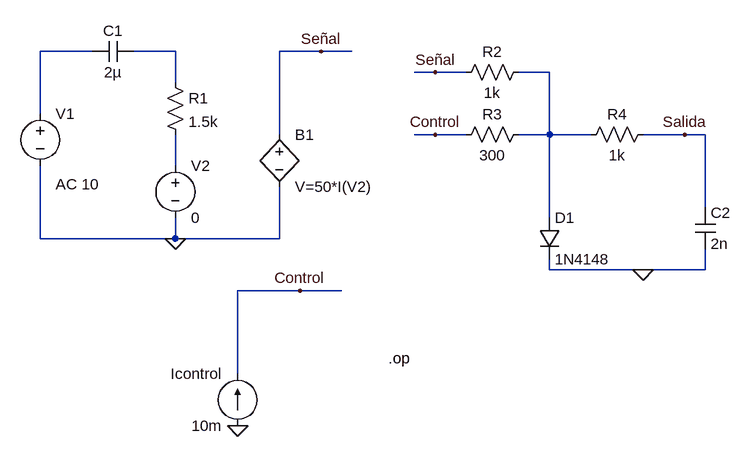
[diagram p0: schematic 2016-10-04 (1).asc]
2016-10-04 (1).asc, the LTspice schematic file:
Version 4
SHEET 1 988 680
WIRE -16 -16 -96 -16
WIRE 112 -16 48 -16
WIRE 336 -16 272 -16
WIRE 384 -16 336 -16
WIRE 512 16 480 16
WIRE 560 16 512 16
WIRE 688 16 640 16
WIRE 112 32 112 -16
WIRE -96 80 -96 -16
WIRE 272 112 272 -16
WIRE 512 112 480 112
WIRE 560 112 512 112
WIRE 688 112 688 16
WIRE 688 112 640 112
WIRE 752 112 688 112
WIRE 896 112 832 112
WIRE 928 112 896 112
WIRE 112 160 112 112
WIRE 928 224 928 112
WIRE 688 240 688 112
WIRE -96 272 -96 160
WIRE 112 272 112 240
WIRE 112 272 -96 272
WIRE 272 272 272 192
WIRE 272 272 112 272
WIRE 688 320 688 304
WIRE 832 320 688 320
WIRE 928 320 928 288
WIRE 928 320 832 320
WIRE 304 352 208 352
WIRE 368 352 304 352
WIRE 208 480 208 352
FLAG 208 560 0
FLAG 832 320 0
FLAG 112 272 0
FLAG 336 -16 Señal
FLAG 512 16 Señal
FLAG 512 112 Control
FLAG 304 352 Control
FLAG 896 112 Salida
SYMBOL cap 48 -32 R90
WINDOW 0 0 32 VBottom 2
WINDOW 3 32 32 VTop 2
SYMATTR InstName C1
SYMATTR Value 2µ
SYMBOL voltage -96 64 R0
WINDOW 123 24 124 Left 2
WINDOW 39 0 0 Left 2
SYMATTR InstName V1
SYMATTR Value ""
SYMATTR Value2 AC 10
SYMBOL voltage 112 144 R0
SYMATTR InstName V2
SYMATTR Value 0
SYMBOL res 96 16 R0
SYMATTR InstName R1
SYMATTR Value 1.5k
SYMBOL current 208 560 R180
WINDOW 0 24 80 Left 2
WINDOW 3 24 0 Left 2
SYMATTR InstName Icontrol
SYMATTR Value 10m
SYMBOL res 656 0 R90
WINDOW 0 0 56 VBottom 2
WINDOW 3 32 56 VTop 2
SYMATTR InstName R2
SYMATTR Value 1k
SYMBOL res 656 96 R90
WINDOW 0 0 56 VBottom 2
WINDOW 3 32 56 VTop 2
SYMATTR InstName R3
SYMATTR Value 300
SYMBOL res 848 96 R90
WINDOW 0 0 56 VBottom 2
WINDOW 3 32 56 VTop 2
SYMATTR InstName R4
SYMATTR Value 1k
SYMBOL cap 912 224 R0
SYMATTR InstName C2
SYMATTR Value 2n
SYMBOL diode 672 240 R0
SYMATTR InstName D1
SYMATTR Value 1N4148
SYMBOL bv 272 96 R0
SYMATTR InstName B1
SYMATTR Value V=50*I(V2)
TEXT 440 456 Left 2 !.op

The netlist it stands for:
* 2016-10-04 (1).asc
C1 N002 N001 2µ
V1 N001 0 AC 10
V2 N004 0 0
R1 N002 N004 1.5k
Icontrol 0 Control 10m
R2 N003 Señal 1k
R3 N003 Control 300
R4 Salida N003 1k
C2 Salida 0 2n
D1 N003 0 1N4148
B1 Señal 0 V=50*I(V2)
.model D D
.lib standard.dio
.op
.backanno
.end